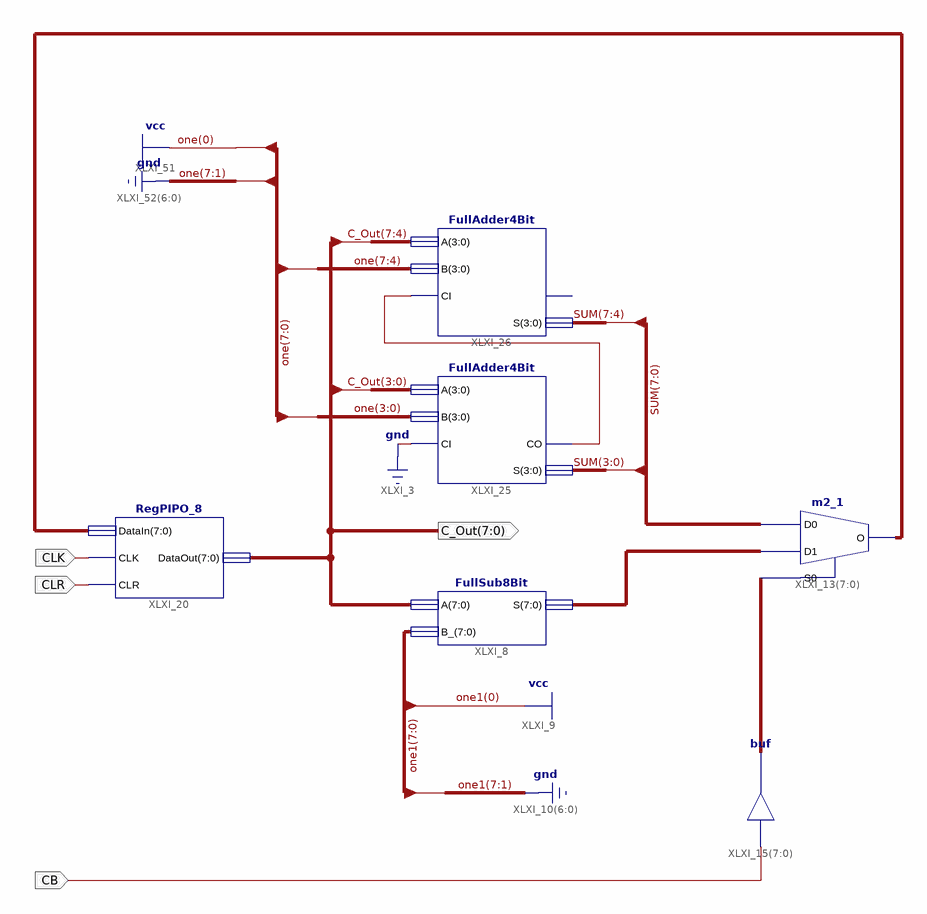
[diagram p0: schematic sheet 1]
// Xilinx ISE schematic Counter_FB_8Bits.sch (spartan6) as structural Verilog: 6 symbols, 4 ports
module Counter_FB_8Bits (
  input  CB,
  input  CLR,
  input  CLK,
  output [7:0] C_Out
);

  wire XLXN_133;
  wire [7:0] SEL, SUM, XLXN_20, XLXN_73;

  FullSub8Bit XLXI_8 (.A(C_Out), .B_(8'b00000001), .S(XLXN_73));
  m2_1 XLXI_13[7:0] (.D0(SUM), .D1(XLXN_73), .S0(SEL), .O(XLXN_20));
  assign SEL = {8{CB}};  // buf XLXI_15[7..0], 8 bits wide
  RegPIPO_8 XLXI_20 (.CLK(CLK), .CLR(CLR), .DataIn(XLXN_20), .DataOut(C_Out));
  FullAdder4Bit XLXI_26 (.A(C_Out[7:4]), .B(4'b0000), .CI(XLXN_133), .S(SUM[7:4]));  // open: CO
  FullAdder4Bit XLXI_25 (.A(C_Out[3:0]), .B(4'b0001), .CI(1'b0), .S(SUM[3:0]), .CO(XLXN_133));
endmodule
